# EAGLE design mac_se_power_switch (EAGLE 9.6.1)
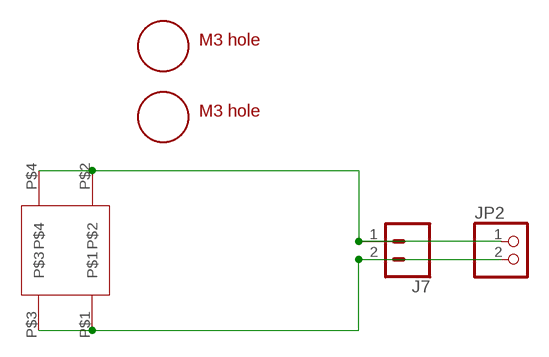
[diagram p0: schematic, sheet 1]

## Parts
J7  CONN_023.5MM-NO_SILK  [SCREWTERMINAL-3.5MM-2-NS]
JP2  PINHD-1X2/90  [1X02/90]
U$1  ROCK_SW  [ROCK_SWITCH]
U$2  M3_MOUNTING_HOLE  [M3_MOUNTING_HOLE_PACK]
U$3  M3_MOUNTING_HOLE  [M3_MOUNTING_HOLE_PACK]

## Nets
N$2: J7.2 JP2.2 U$1.P$1 U$1.P$3
N$3: J7.1 JP2.1 U$1.P$2 U$1.P$4

## Library data of the parts
J7 = atx_power_control:CONN_02: Multi connection point. Often used as Generic Header-pin footprint for 0.1 inch spaced/style header connections On any of the 0.1 inch spaced packages, you can populate with these: Break Away Headers - Straight <https://www.sparkfun.com/products/116> (PRT-00116) Break Away Male Headers - Right Angle <https://www.sparkfun.com/products/553> (PRT-00553) Female Headers <https://www.sparkfun.com/products/115> (PRT-00115) Break Away Headers - Machine Pin <https://www.sparkfun.com/products/117> (PRT-00117) Break Away Female Headers - Swiss Machine Pin <https://www.sparkfun.com/products/743> (PRT-00743) For SCREWTERMINALS and SPRING TERMINALS visit here: Screw Terimnals on SparkFun.com <https://www.sparkfun.com/search/results?term=Screw+Terminals> (5mm/3.5mm/2.54mm spacing) This device is also useful as a general connection point to wire up your design to another part of your project. Our various solder wires solder well into these plated through hole pads. Hook-Up Wire - Assortment (Stranded, 22 AWG) <https://www.sparkfun.com/products/11375> (PRT-11375) Hook-Up Wire - Assortment (Solid Core, 22 AWG) <https://www.sparkfun.com/products/11367> (PRT-11367) View the entire wire category on our website here <https://www.sparkfun.com/categories/141> Special notes: Molex polarized connector foot print use with: PRT-08233 with associated crimp pins and housings. 2.54_SCREWTERM for use with PRT-10571. 3.5mm Screw Terminal footprints for PRT-08084 5mm Screw Terminal footprints for use with PRT-08432; PROD_ID: CONN-13512; SF_ID: PRT-09918; SF_SKU: PRT-08432; SKU: PRT-09914
JP2 = pinhead:PINHD-1X2: PIN HEADER
U$1 = atx4vc:ROCK_SW
U$2 U$3 = a:M3_MOUNTING_HOLE

## Board
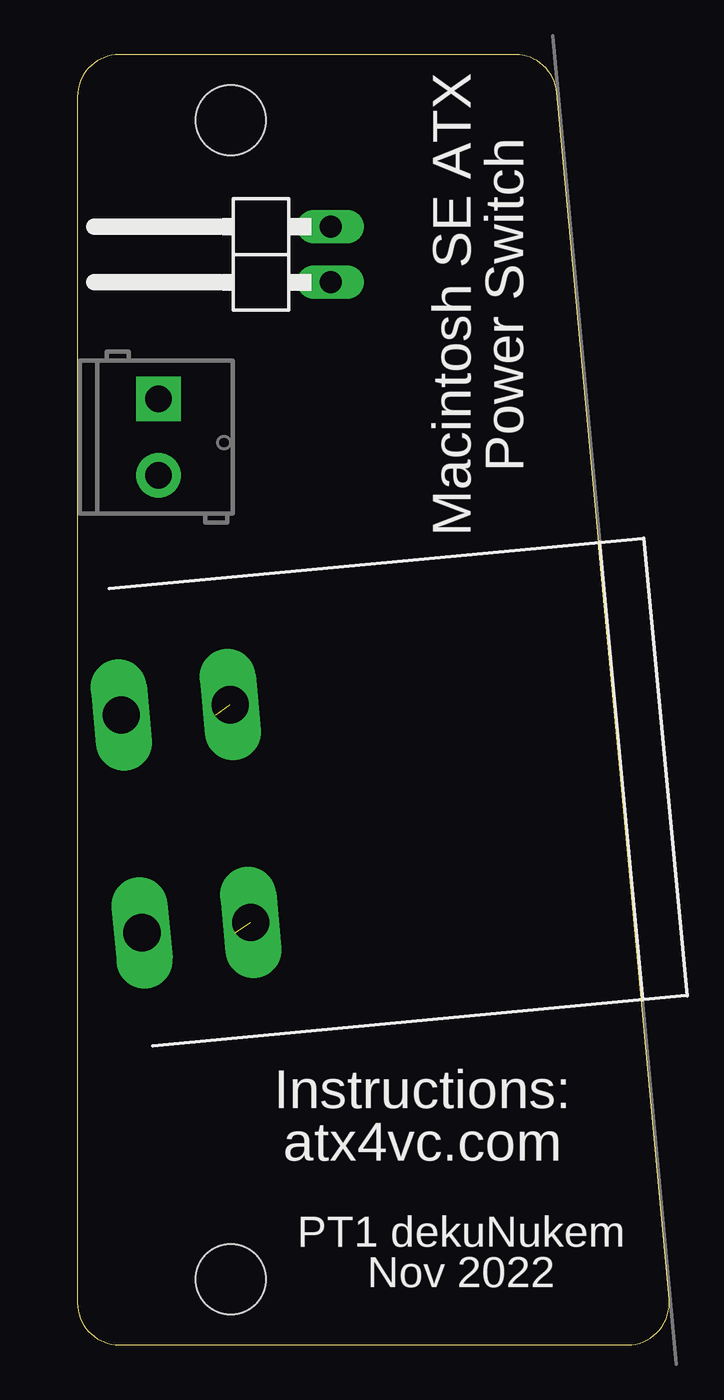
[diagram p1: board, top side]
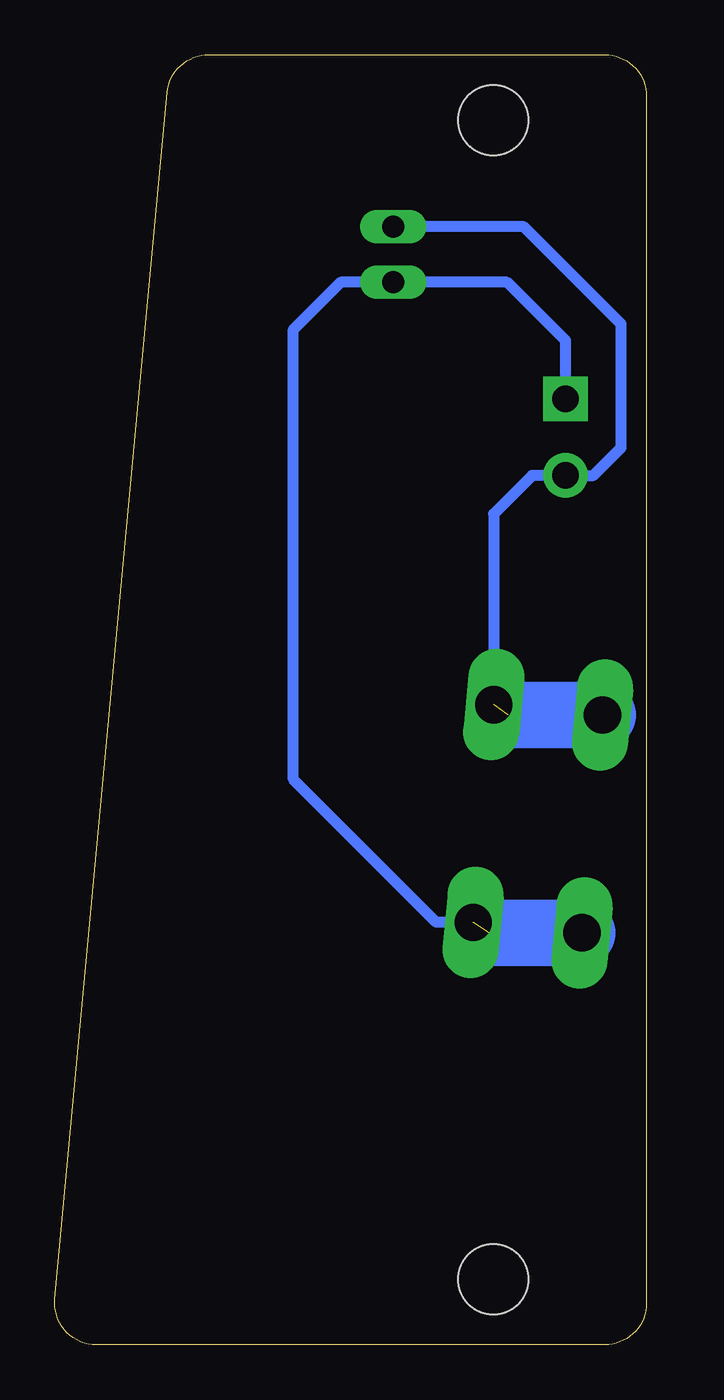
[diagram p2: board, bottom side, seen from below]

Size 27.05 x 59 mm. Coordinates in mm from the lower left corner, seen from the top.
Outline: 20.01,59 1.91,59 arc90 0,57.09 0,1.91 arc90 1.91,0 25.15,0 arc95 27.04,2.08 21.91,57.27 arc85 20.01,59
Copper layers (1*16): Top 0.035mm / dielectric 1.5mm / Bottom 0.035mm
Design rules "deku_2layer_6mil *": minimum track width 6mil, minimum drill 15mil, track to track 20mil, track to pad 6mil, pad to pad 6mil, via to via 6mil, smd to smd 6mil, copper to edge 10mil, drill to drill 6mil, minimum pad ring 7mil, minimum via ring 7mil, stop-mask expansion 4mil, vias tented up to drill 25mil, thermal gap 10mil

### Footprints (pad centres in the part's own frame; a part is rotated, then mirrored left to right if it is on the bottom)
SCREWTERMINAL-3.5MM-2-NS = drill 1.2 pad 2.032 square: 1 0,0 | drill 1.2 pad 2.032: 2 3.5,0
1X02/90 = drill 1.016 long: 1 -1.27,-3.81; 2 1.27,-3.81
ROCK_SWITCH = drill 1.7 long: P$1 -4.7,0; P$2 5.3,0; P$3 -4.7,5; P$4 5.3,5
M3_MOUNTING_HOLE_PACK = hole 3.2: 0,0

### Placement (x,y rotation side)
J7  3.7,43.26 270 top
JP2  7.76,49.86 90 top
U$1  2.45,24.12 275.4 top
U$2  7,3 0 top
U$3  7,56 0 top

### Tracks (layer width: path | path; a pad name or v marks a point on that pad's centre or on a via)
N$2  (1 unrouted)
  Bottom 0.508: JP2.2 5.6,51.13 1.16,46.69 1.16,41.03 2.43,39.76 J7.2 5.22,39.76 6.98,38 U$1.P$3
  Bottom 3.048: U$1.P$1 6.31,28.81
N$3  (1 unrouted)
  Bottom 0.508: J7.1 3.7,45.93 6.37,48.59 JP2.1 13.98,48.59 16.14,46.43 16.14,25.86 9.6,19.32 U$1.P$4
  Bottom 3.048: U$1.P$2 7.18,18.84

### Text on the board
tNames: Macintosh SE ATX / Power Switch | Instructions: / atx4vc.com | PT1 dekuNukem / Nov 2022